# EAGLE board sensormain_Exodia ver2 (EAGLE 9.6.2)
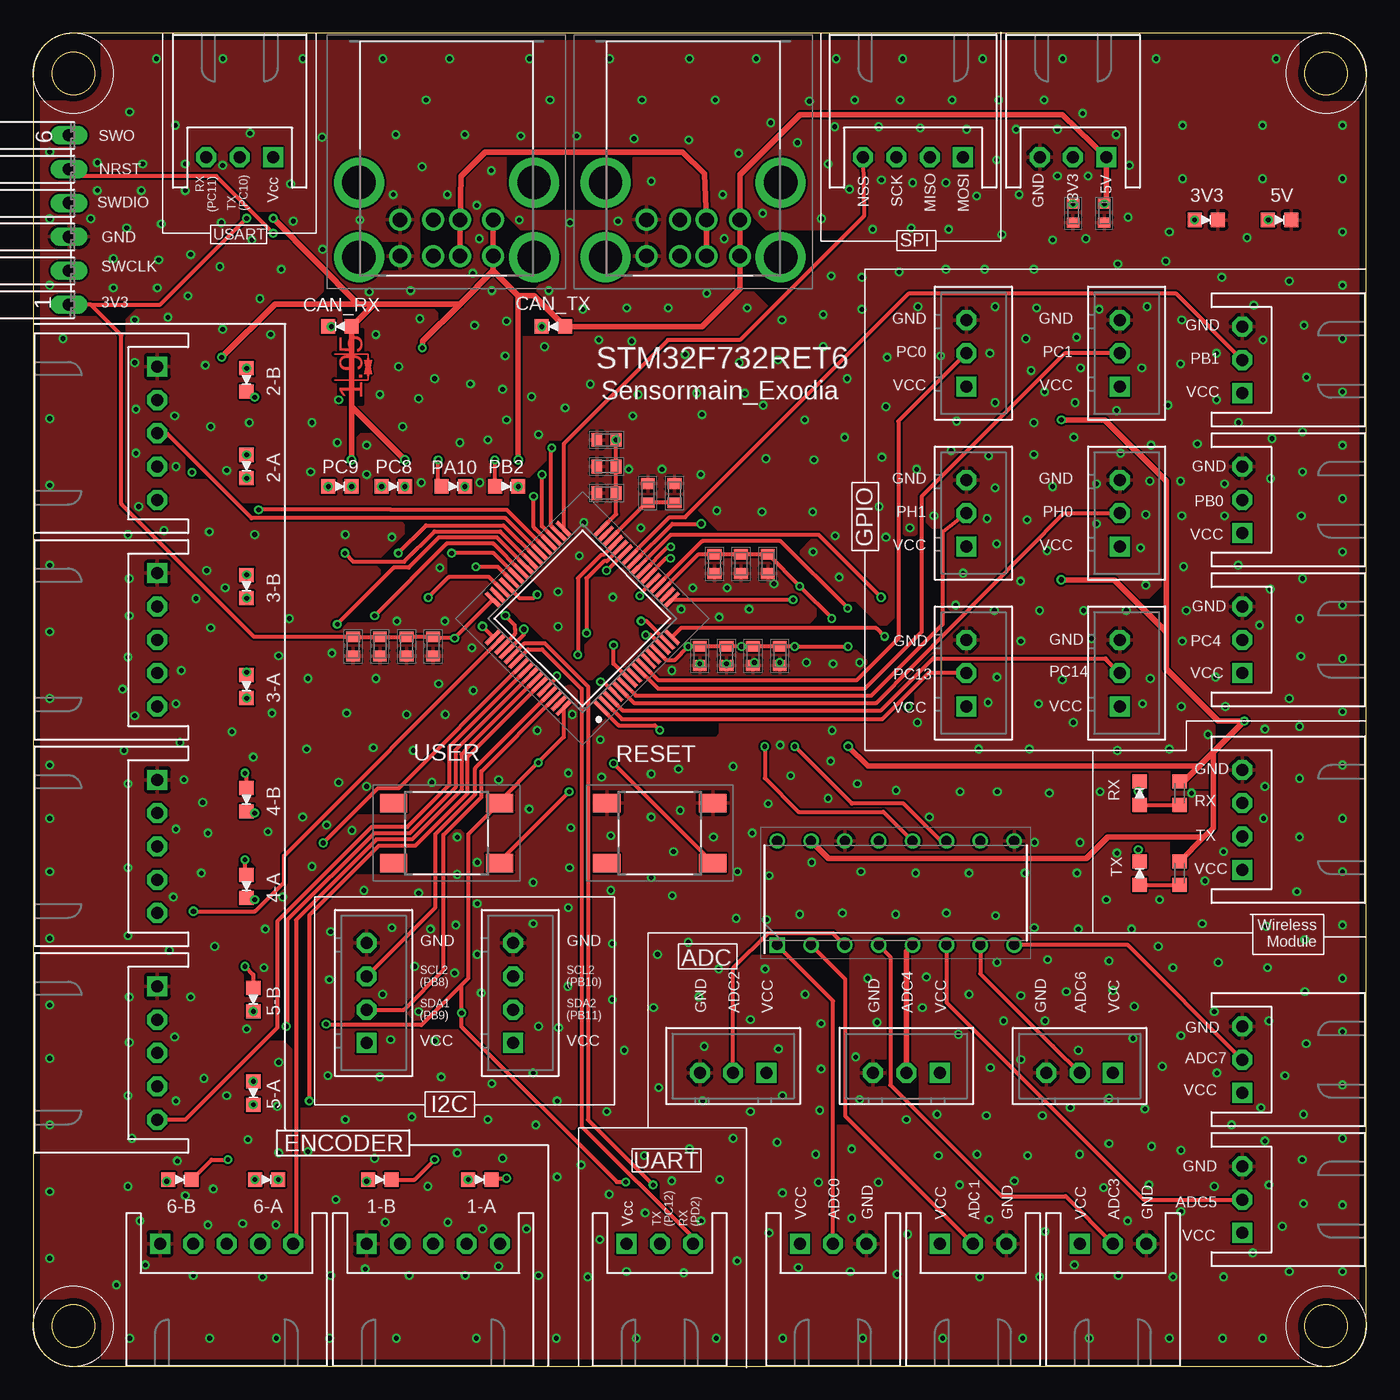
[diagram p5: board, top side]
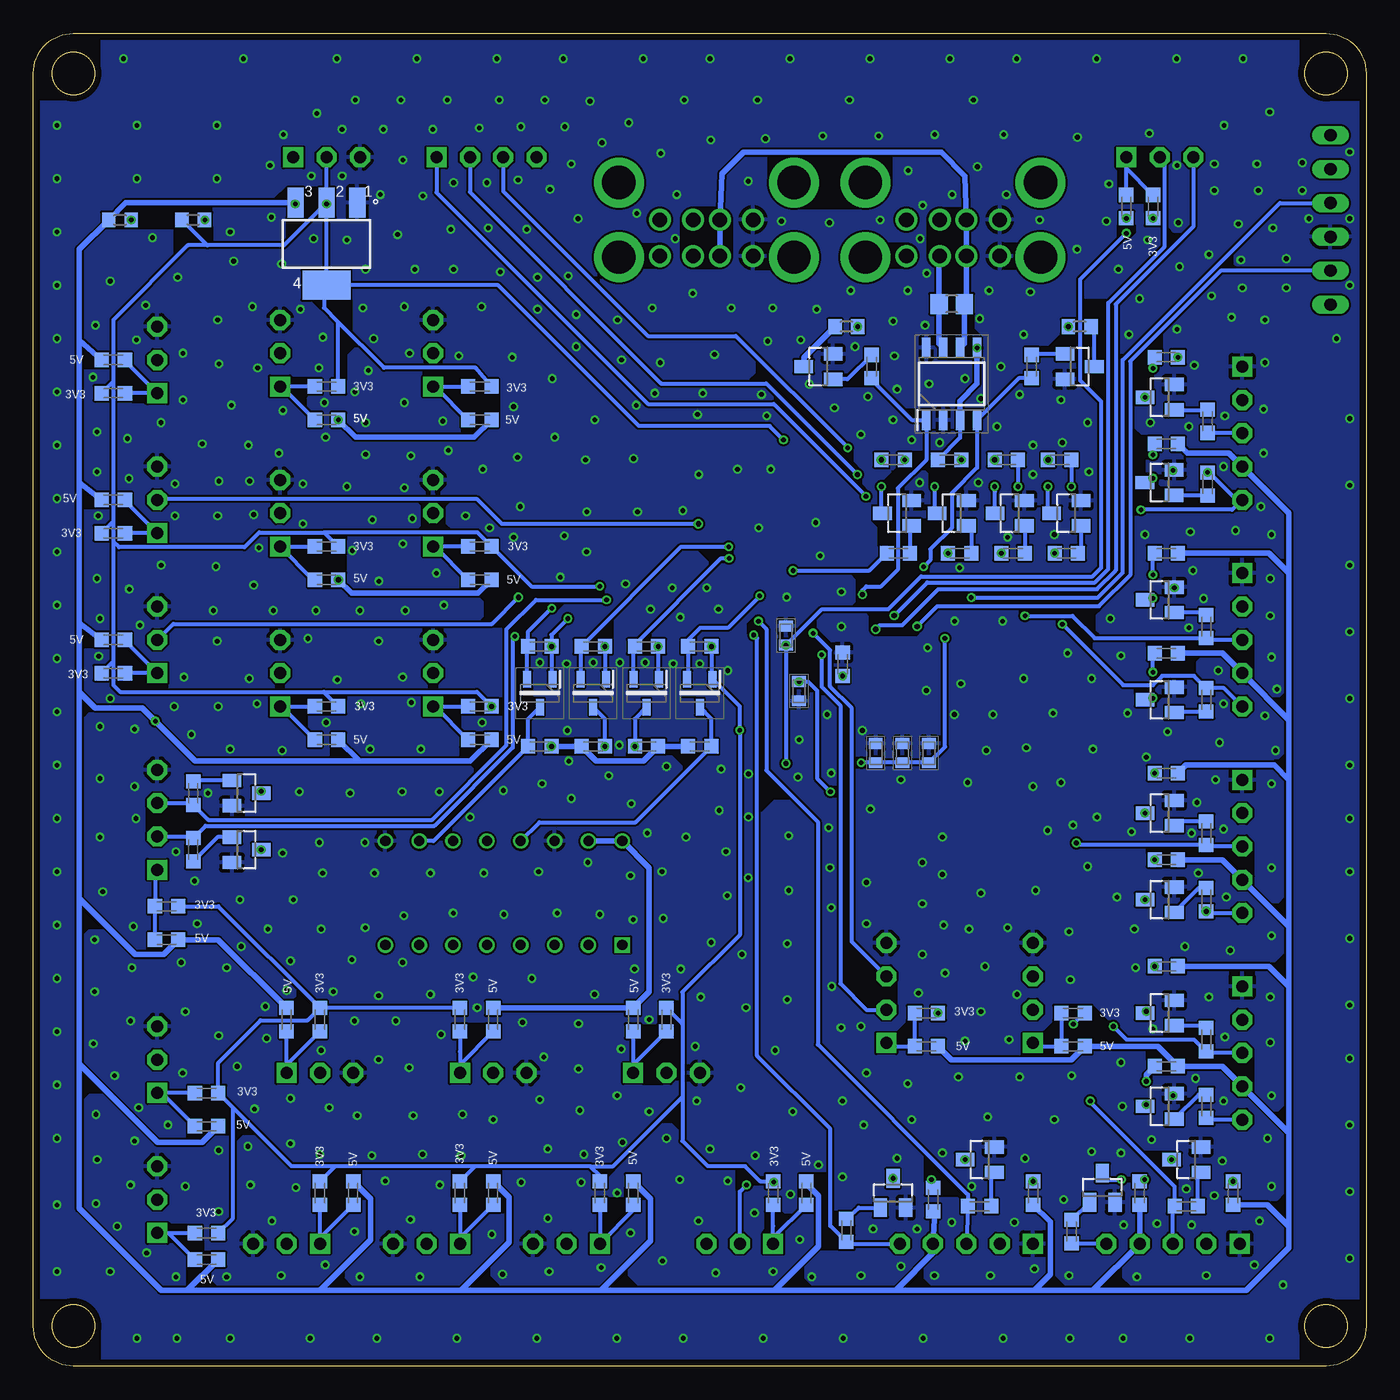
[diagram p6: board, bottom side, seen from below]

Size 100 x 100 mm. Coordinates in mm from the lower left corner, seen from the top.
Outline: 3,0 97,0 arc90 100,3 100,97 arc90 97,100 3,100 arc90 0,97 0,3 arc90 3,0
Outline: circle at 3,3 radius 1.6
Outline: circle at 3,97 radius 1.6
Outline: circle at 97,97 radius 1.6
Outline: circle at 97,3 radius 1.6
Copper layers (1*16): Top 0.035mm / dielectric 1.6mm / Bottom 0.035mm
Design rules "Elecrow_2-layer_PCB_eagle_rule": minimum track width 6mil, minimum drill 12mil, track to track 6mil, track to pad 6mil, pad to pad 6mil, via to via 8mil, smd to smd 0mil, copper to edge 20mil, drill to drill 10mil, minimum pad ring 6mil, minimum via ring 6mil, stop-mask expansion 0mil, vias tented up to drill 100mil, thermal gap 10mil
tRestrict: 181 lines
bRestrict: 311 lines

## Footprints (pad centres in the part's own frame; a part is rotated, then mirrored left to right if it is on the bottom)
LED1608 = smd 1.05 x 1.08: A -0.875,0; K 0.875,0
CAPC1709X100N = smd 0.81 x 1.04: 1 -0.72,0; 2 0.72,0
CAPC1608X90N = smd 0.75 x 0.94: 1 -0.7,0; 2 0.7,0
QFP50P1200X1200X160-64N = smd 1.475 x 0.3: 1 -5.738,3.75; 2 -5.738,3.25; 3 -5.738,2.75; 4 -5.738,2.25; 5 -5.738,1.75; 6 -5.738,1.25; 7 -5.738,0.75; 8 -5.738,0.25; 9 -5.738,-0.25; 10 -5.738,-0.75; 11 -5.738,-1.25; 12 -5.738,-1.75; 13 -5.738,-2.25; 14 -5.738,-2.75; 15 -5.738,-3.25; 16 -5.738,-3.75; 33 5.738,-3.75; 34 5.738,-3.25; 35 5.738,-2.75; 36 5.738,-2.25; 37 5.738,-1.75; 38 5.738,-1.25; 39 5.738,-0.75; 40 5.738,-0.25; 41 5.738,0.25; 42 5.738,0.75; 43 5.738,1.25; 44 5.738,1.75; 45 5.738,2.25; 46 5.738,2.75; 47 5.738,3.25; 48 5.738,3.75 | smd 0.3 x 1.475: 17 -3.75,-5.738; 18 -3.25,-5.738; 19 -2.75,-5.738; 20 -2.25,-5.738; 21 -1.75,-5.738; 22 -1.25,-5.738; 23 -0.75,-5.738; 24 -0.25,-5.738; 25 0.25,-5.738; 26 0.75,-5.738; 27 1.25,-5.738; 28 1.75,-5.738; 29 2.25,-5.738; 30 2.75,-5.738; 31 3.25,-5.738; 32 3.75,-5.738; 49 3.75,5.738; 50 3.25,5.738; 51 2.75,5.738; 52 2.25,5.738; 53 1.75,5.738; 54 1.25,5.738; 55 0.75,5.738; 56 0.25,5.738; 57 -0.25,5.738; 58 -0.75,5.738; 59 -1.25,5.738; 60 -1.75,5.738; 61 -2.25,5.738; 62 -2.75,5.738; 63 -3.25,5.738; 64 -3.75,5.738
SOIC127P600X175-8N = smd 1.5 x 0.65: 1 -2.7,1.905; 2 -2.7,0.635; 3 -2.7,-0.635; 4 -2.7,-1.905; 5 2.7,-1.905; 6 2.7,-0.635; 7 2.7,0.635; 8 2.7,1.905
DIP781W56P254L1918H533Q16N = drill 0.759 pad 1.159 square: 1 -3.905,8.89 | drill 0.759 pad 1.159: 2 -3.905,6.35; 3 -3.905,3.81; 4 -3.905,1.27; 5 -3.905,-1.27; 6 -3.905,-3.81; 7 -3.905,-6.35; 8 -3.905,-8.89; 9 3.905,-8.89; 10 3.905,-6.35; 11 3.905,-3.81; 12 3.905,-1.27; 13 3.905,1.27; 14 3.905,3.81; 15 3.905,6.35; 16 3.905,8.89
USB4AF203AS = drill 1.1 pad 1.65: 1 0,0; 2 2.5,0; 3 4.5,0; 4 7,0; 5 0,-2.71; 6 2.5,-2.71; 7 4.5,-2.71; 8 7,-2.71 | drill 2.5 pad 3.75: MH1 -3.07,0.09; MH2 10.07,0.09; MH3 -3.07,-5.51; MH4 10.07,-5.51
SOT96P237X111-3N = smd 1.25 x 0.6: 1 -1.05,0.955; 2 -1.05,-0.955; 3 1.05,0
SOT-23 = smd 1 x 1.4: 1 -0.95,-1.1; 2 0.95,-1.1; 3 0,1.1
1608 = smd 1.05 x 1.08: 1 -0.875,0; 2 0.875,0
R0603 = smd 1 x 1.1: 1 -0.85,0; 2 0.85,0
SMD1608 = smd 1.05 x 1.08: 1 -0.875,0; 2 0.875,0
R0805 = smd 1.3 x 1.5: 1 -0.95,0; 2 0.95,0
TSHAT25B219E = smd 2.05 x 1.4: A1 -3.975,2.25; B1 3.975,2.25; C1 -3.975,-2.25; D1 3.975,-2.25
06PA = drill 0.914 long: 1 -6.35,0; 2 -3.81,0; 3 -1.27,0; 4 1.27,0; 5 3.81,0; 6 6.35,0
SOT223 = smd 2.235 x 1.219: 1 -3.099,2.311; 2 -3.099,0; 3 -3.099,-2.311 | smd 2.2 x 3.6: 4 3.099,0
S5B-XH-A = drill 0.9 pad 1.5 square: 1 5,0 | drill 0.9 pad 1.5 octagon: 2 2.5,0; 3 0,0; 4 -2.5,0; 5 -5,0
B3B-XH-A = drill 0.9 pad 1.5 square: 1 2.5,0 | drill 0.9 pad 1.5 octagon: 2 0,0; 3 -2.5,0
S4B-XH-A = drill 0.9 pad 1.5 square: 1 3.75,0 | drill 0.9 pad 1.5 octagon: 2 1.25,0; 3 -1.25,0; 4 -3.75,0
S3B-XH-A = drill 0.9 pad 1.5 square: 1 2.5,0 | drill 0.9 pad 1.5 octagon: 2 0,0; 3 -2.5,0
B4B-XH-A = drill 0.9 pad 1.5 square: 1 3.75,0 | drill 0.9 pad 1.5 octagon: 2 1.25,0; 3 -1.25,0; 4 -3.75,0

## Placement (x,y rotation side)
1-A  LED1608  [LED1608]  33.5,14 0 top
1-B  LED1608  [LED1608]  26,14 0 top
2-A  LED1608  [LED1608]  16,67.5 270 top
2-B  LED1608  [LED1608]  16,74 270 top
3-A  LED1608  [LED1608]  16,51 270 top
3-B  LED1608  [LED1608]  16,58.5 270 top
3V3  LED1608  [LED1608]  88,86 0 top
4-A  LED1608  [LED1608]  16,36 270 top
4-B  LED1608  [LED1608]  16,42.5 270 top
5-A  LED1608  [LED1608]  16.5,20.5 270 top
5-B  LED1608  [LED1608]  16.5,27.5 270 top
5V  LED1608  [LED1608]  93.5,86 0 top
6-A  LED1608  [LED1608]  17.5,14 0 top
6-B  LED1608  [LED1608]  11,14 0 top
C1  100n  [CAPC1709X100N]  42.55,50.64 90 bottom
C2  10uF  [CAPC1608X90N]  78,86.5 90 top
C3  100n  [CAPC1709X100N]  50,53.3 90 top
C4  1u  [CAPC1709X100N]  56,53.3 90 top
C5  100n  [CAPC1709X100N]  30,54 90 top
C6  100n  [CAPC1709X100N]  28,54 90 top
C7  100n  [CAPC1709X100N]  26,54 90 top
C8  100n  [CAPC1709X100N]  43,69.5 0 top
C9  100n  [CAPC1709X100N]  43,67.5 0 top
C10  100n  [CAPC1709X100N]  43,65.5 0 top
C11  100n  [CAPC1709X100N]  53.1,60.2 90 top
C12  100n  [CAPC1709X100N]  51.1,60.2 90 top
C13  100n  [CAPC1709X100N]  55.1,60.2 90 top
C14  100n  [CAPC1709X100N]  32.8,46 270 bottom
C15  100n  [CAPC1709X100N]  34.8,46 270 bottom
C16  100n  [CAPC1709X100N]  36.8,46 270 bottom
C17  4.7u  [CAPC1709X100N]  24,54 90 top
C18  100n  [CAPC1709X100N]  52,53.3 90 top
C19  1u  [CAPC1709X100N]  54,53.3 90 top
C20  2.2u  [CAPC1709X100N]  46.1,65.5 270 top
C21  2.2u  [CAPC1709X100N]  48.1,65.5 270 top
C22  100n  [CAPC1608X90N]  80.35,86.5 90 top
C23  100n  [CAPC1709X100N]  43.53,54.82 270 bottom
CAN_RX  LED1608  [LED1608]  23,78 180 top
CAN_TX  LED1608  [LED1608]  39,78 180 top
IC1  STM32F732RET6  [QFP50P1200X1200X160-64N]  41.2,56.1 135 top
IC2  NCV7351D1ER2G  [SOIC127P600X175-8N]  31.1,73.7 90 bottom
IC4  MCP3208-CI_P  [DIP781W56P254L1918H533Q16N]  64.7,35.5 90 top
J1  USB-4AF203AS  [USB4AF203AS]  53,83.3 180 top
J2  USB-4AF203AS  [USB4AF203AS]  34.5,83.3 180 top
PA10  LED1608  [LED1608]  31.5,66 0 top
PB2  LED1608  [LED1608]  35.5,66 0 top
PC8  LED1608  [LED1608]  27,66 0 top
PC9  LED1608  [LED1608]  23,66 0 top
Q1  BSS138LT7G  [SOT96P237X111-3N]  62,50.5 270 bottom
Q2  BSS138LT7G  [SOT96P237X111-3N]  58,50.5 270 bottom
Q3  BSS138LT7G  [SOT96P237X111-3N]  54,50.5 270 bottom
Q5  BSS138LT7G  [SOT96P237X111-3N]  50,50.5 270 bottom
Q9  SOT-23_NMOS  [SOT-23]  41.1,75 90 bottom
Q10  SOT-23_NMOS  [SOT-23]  21.5,75 270 bottom
R1  10k  [1608]  39.28,52.66 90 bottom
R2  1k  [R0603]  88,86 0 bottom
R3  1k  [R0603]  93.5,86 0 bottom
R4  10k  [SMD1608]  12,35 90 bottom
R5  120  [R0805]  31.1,79.7 180 bottom
R6  1k  [SMD1608]  15,38 180 bottom
R7  10k  [SMD1608]  12,19.5 90 bottom
R8  1k  [SMD1608]  15,22.5 180 bottom
R9  10k  [SMD1608]  22.1,10.1 90 bottom
R10  1k  [SMD1608]  17,13 90 bottom
R11  10k  [SMD1608]  29,12 0 bottom
R12  1k  [SMD1608]  25,13 270 bottom
R13  10k  [SMD1608]  11.9,70.9 90 bottom
R14  1k  [SMD1608]  15,75.7 180 bottom
R15  10k  [SMD1608]  12,55.5 90 bottom
R16  1k  [SMD1608]  15,61 180 bottom
R17  10k  [SMD1608]  12,40 90 bottom
R18  1k  [SMD1608]  15,44.5 180 bottom
R19  10k  [SMD1608]  12,24.5 90 bottom
R20  1k  [SMD1608]  15,30 180 bottom
R21  10k  [SMD1608]  13.5,12 0 bottom
R22  1k  [SMD1608]  10,13 90 bottom
R23  10k  [SMD1608]  62,54 180 bottom
R24  10k  [SMD1608]  62,46.5 180 bottom
R25  10k  [SMD1608]  58,54 180 bottom
R26  10k  [SMD1608]  58,46.5 0 bottom
R27  10k  [SMD1608]  54,54 180 bottom
R28  10k  [SMD1608]  54,46.5 180 bottom
R29  10k  [SMD1608]  50,54 180 bottom
R30  10k  [SMD1608]  50,46.5 0 bottom
R31  0  [SMD1608]  90,34.5 0 bottom
R32  0  [SMD1608]  90,32 0 bottom
R33  [SMD1608]  68,13 270 bottom
R34  [SMD1608]  65.5,13 270 bottom
R35  [SMD1608]  57.5,13 270 bottom
R36  [SMD1608]  55,13 270 bottom
R37  [SMD1608]  52.5,26 270 bottom
R38  [SMD1608]  55,26 270 bottom
R39  [SMD1608]  78.5,13 270 bottom
R40  [SMD1608]  76,13 270 bottom
R41  [SMD1608]  68,26 270 bottom
R42  [SMD1608]  65.5,26 270 bottom
R43  [SMD1608]  87,10 180 bottom
R44  [SMD1608]  87,8 180 bottom
R45  [SMD1608]  78.5,26 270 bottom
R46  [SMD1608]  81,26 270 bottom
R47  10k  [SMD1608]  39,10.2 90 bottom
R48  1k  [SMD1608]  32.5,12.5 90 bottom
R49  10k  [SMD1608]  11.9,66.18 270 bottom
R50  1k  [SMD1608]  15,69.2 180 bottom
R51  [SMD1608]  87,20.5 180 bottom
R52  [SMD1608]  87,18 180 bottom
R53  10k  [SMD1608]  12,50 270 bottom
R54  1k  [SMD1608]  15,53.5 180 bottom
R55  10k  [SMD1608]  88,38.75 270 bottom
R56  1k  [SMD1608]  86,37 270 top
R57  10k  [SMD1608]  88,43 90 bottom
R58  1k  [SMD1608]  86,43 270 top
R59  10k  [SMD1608]  30.5,61 0 bottom
R60  1k  [SMD1608]  31.25,68 0 bottom
R61  10k  [SMD1608]  22.5,61 0 bottom
R62  1k  [SMD1608]  23,68 0 bottom
R63  10k  [SMD1608]  26.5,61 0 bottom
R64  1k  [SMD1608]  27,68 0 bottom
R65  10k  [SMD1608]  35.1,61 0 bottom
R66  1k  [SMD1608]  35.5,68 0 bottom
R67  0  [SMD1608]  33,26.5 0 bottom
R68  0  [SMD1608]  33,24 0 bottom
R69  0  [SMD1608]  22,26.5 0 bottom
R70  0  [SMD1608]  22,24 0 bottom
R71  0  [SMD1608]  16,87 270 bottom
R72  0  [SMD1608]  18,87 270 bottom
R73  0  [SMD1608]  44.5,13 90 bottom
R74  0  [SMD1608]  42,13 90 bottom
R75  1k  [R0603]  39,78 180 bottom
R76  1k  [R0603]  21.5,78 0 bottom
R77  10k  [SMD1608]  37.1,75 270 bottom
R78  10k  [SMD1608]  25.1,75 270 bottom
R81  [SMD1608]  78,73.5 180 bottom
R82  [SMD1608]  78,71 180 bottom
R85  [SMD1608]  66.5,73.5 180 bottom
R86  [SMD1608]  66.5,71 180 bottom
R87  [SMD1608]  94,52 0 bottom
R88  [SMD1608]  94,54.5 0 bottom
R89  [SMD1608]  94,62.5 0 bottom
R90  [SMD1608]  94,65 0 bottom
R91  [SMD1608]  94,73 0 bottom
R92  [SMD1608]  94,75.5 0 bottom
R95  [SMD1608]  78,61.5 180 bottom
R96  [SMD1608]  78,59 180 bottom
R97  [SMD1608]  66.5,61.5 180 bottom
R98  [SMD1608]  66.5,59 180 bottom
R99  [SMD1608]  66.5,49.5 180 bottom
R100  [SMD1608]  66.5,47 180 bottom
R101  [SMD1608]  78,49.5 180 bottom
R102  [SMD1608]  78,47 180 bottom
RX  LED1608  [LED1608]  83,43 90 top
S1  TSHA-T-2.5B2-19E  [TSHAT25B219E]  31,40 180 top
S2  TSHA-T-2.5B2-19E  [TSHAT25B219E]  47,40 180 top
SL1  [06PA]  2.68,86 90 top
TR1  2SC2712GR  [SOT-23]  15.5,35 90 bottom
TR2  2SC2712GR  [SOT-23]  15.5,19.5 90 bottom
TR3  2SC2712GR  [SOT-23]  19.8,13.4 0 bottom
TR4  2SC2712GR  [SOT-23]  29,15.5 90 bottom
TR5  2SC2712GR  [SOT-23]  15.5,72.7 90 bottom
TR6  2SC2712GR  [SOT-23]  15.5,57.5 90 bottom
TR7  2SC2712GR  [SOT-23]  15.5,41.5 90 bottom
TR8  2SC2712GR  [SOT-23]  15.5,26.5 90 bottom
TR9  2SC2712GR  [SOT-23]  13.5,15.5 90 bottom
TR10  2SC2712GR  [SOT-23]  84,38.75 270 bottom
TR11  2SC2712GR  [SOT-23]  84,43 270 bottom
TR12  2SC2712GR  [SOT-23]  31.1,64 90 bottom
TR13  2SC2712GR  [SOT-23]  22.5,64 90 bottom
TR14  2SC2712GR  [SOT-23]  26.75,64 90 bottom
TR15  2SC2712GR  [SOT-23]  35.5,13 0 bottom
TR16  2SC2712GR  [SOT-23]  15.51,66.3 90 bottom
TR17  2SC2712GR  [SOT-23]  35.2,64 90 bottom
TR21  2SC2712GR  [SOT-23]  15.5,50 90 bottom
TX  LED1608  [LED1608]  83,37 90 top
U1  LD1117S33CTR  [SOT223]  78,84.2 270 bottom
X1  S5B-XH-A  [S5B-XH-A]  30,9.2 180 top
X2  S5B-XH-A  [S5B-XH-A]  9.3,70 90 top
X3  S5B-XH-A  [S5B-XH-A]  9.3,54.5 90 top
X4  S5B-XH-A  [S5B-XH-A]  9.3,39 90 top
X5  S5B-XH-A  [S5B-XH-A]  9.3,23.5 90 top
X6  S5B-XH-A  [S5B-XH-A]  14.5,9.2 180 top
X7  B3B-XH-A  [B3B-XH-A]  52.5,22 0 top
X8  S4B-XH-A  [S4B-XH-A]  66,90.7 0 top
X9  S4B-XH-A  [S4B-XH-A]  90.7,41 270 top
X10  B3B-XH-A  [B3B-XH-A]  65.5,22 0 top
X11  S3B-XH-A  [S3B-XH-A]  47,9.2 180 top
X12  S3B-XH-A  [S3B-XH-A]  60,9.2 180 top
X13  S3B-XH-A  [S3B-XH-A]  15.48,90.7 0 top
X14  B4B-XH-2  [B4B-XH-A]  25,28 270 top
X17  B4B-XH-2  [B4B-XH-A]  36,28 270 top
X18  S3B-XH-A  [S3B-XH-A]  90.7,12.5 270 top
X20  B3B-XH-A  [B3B-XH-A]  78.5,22 0 top
X21  S3B-XH-A  [S3B-XH-A]  90.7,23 270 top
X22  S3B-XH-A  [S3B-XH-A]  78,90.7 0 top
X23  S3B-XH-A  [S3B-XH-A]  81,9.2 180 top
X24  B3B-XH-A  [B3B-XH-A]  81.5,76 270 top
X25  S3B-XH-A  [S3B-XH-A]  70.5,9.2 180 top
X27  B3B-XH-A  [B3B-XH-A]  70,76 270 top
X28  S3B-XH-A  [S3B-XH-A]  90.7,54.5 270 top
X29  S3B-XH-A  [S3B-XH-A]  90.7,65 270 top
X30  S3B-XH-A  [S3B-XH-A]  90.7,75.5 270 top
X32  B3B-XH-A  [B3B-XH-A]  81.5,64 270 top
X33  B3B-XH-A  [B3B-XH-A]  70,64 270 top
X34  B3B-XH-A  [B3B-XH-A]  70,52 270 top
X35  B3B-XH-A  [B3B-XH-A]  81.5,52 270 top

## Tracks (layer width: path | path; a pad name or v marks a point on that pad's centre or on a via)
3V3  (via drill 0.35)
  Top 0.305: IC1.19 49.91,60.92 C12.2 C11.2 C13.2 v57.51,58.51 59.9,56.12 v59.9,56.1 | IC1.48 v31.61,54.62 30.1,54.62 C5.2 C6.2 C7.2 C17.2 16.58,54.72 6.6,64.7 6.6,77.35 4.3,79.65 | IC1.64 39.79,47.2 v37.88,45.28 34.98,42.38 S1.C1 32.62,39.9 32.62,29.1 32.12,28.6 | IC1.13 47.48,53 48.12,53 R29.1 49.15,54.02 C3.2 C18.2 53.1,54.02 R27.1 53.15,54.02 C19.2 C4.2 57.1,54.02 R25.1 R23.1 | 32.12,28.6 R67.2 32.12,25.48 43.78,13.82 v44.44,13.82 | 32.12,28.6 29.12,25.6 22.03,25.6 v21.97,25.67 | 4.3,79.65 9.53,79.65 R71.2 | 4.3,79.65 SL1.1 | IC1.32 43.72,63.92 C10.2 C9.2 C8.2 | v47,47.72 46.63,48.09 43.91,48.09 IC1.1
  Bottom 0.305: U1.2 81.2,84.1 86.95,84.1 | 86.95,84.1 R2.1 | U1.4 U1.2 | U1.2 X22.2 | R101.1 77.19,49.58 78.2,50.6 | R41.1 R45.1 | 58.23,15 57.5,14.28 R35.1 | R33.1 66.88,15 | 58.23,15 66.88,15 | 66.88,15 77.38,15 | 77.38,15 R39.1 | 77.38,15 80.62,15 85.01,19.39 | 85.01,19.39 R51.1 86.12,22.77 82.94,25.95 79.42,25.95 R45.1 | R43.1 85.01,11.11 85.01,19.39 | 58.23,15 56.5,15 51.3,20.2 | 51.3,25.68 51.3,20.2 | 51.3,25.68 R37.1 | R31.2 86.12,34.5 R45.1 | v37.88,45.28 C16.2 C15.2 C14.2 31.61,46.48 v31.61,54.62 | U1.4 65.12,81.1 54.56,70.54 44.76,70.54 C8.2 | R85.1 66.83,74.9 73.7,74.9 77.12,78.33 | 77.12,78.33 78.2,79.4 78.2,80.9 U1.4 | 51.3,20.2 51.3,16.9 49.4,15 46.6,15 45.48,13.88 R73.2 v44.44,13.82 | 86.95,84.1 88.4,84.1 94,78.5 94,73.88 | 94,73.88 R91.1 | 94,73.88 94,63.38 | 94,63.38 R89.1 | 94,63.38 94,61.88 | 94,61.88 94,52.88 | 94,52.88 R87.1 | 94,52.88 94,51.1 93.5,50.6 78.2,50.6 | 51.3,25.68 51.3,28.07 47,32.38 v47,47.72 47,49.51 Q5.1 49.12,51.63 R29.1 | v21.97,25.67 R69.2 | R81.1 77.12,78.33 | 78.2,50.6 66.72,50.6 R99.1 | 78.18,62.55 83.05,62.55 84.16,61.45 93.57,61.45 94,61.88 | 78.18,62.55 66.68,62.55 R97.1 62.63,58.51 v57.51,58.51 | Q1.1 61.12,51.63 R23.1 61.12,54.88 v59.9,56.1 | R25.1 57.12,51.63 Q2.1 | R27.1 53.12,51.63 Q3.1 | R95.1 78.18,62.55
  Bottom 0.406: U1.2 78.07,87.23 C2.2
  other vias: 78,87.2 43.72,69.5 32.12,26.5 16,86.12 49.12,54 53.12,54 57.12,54 61.12,54 65.62,49.5
5V  (via drill 0.35, 0.4)
  Top 0.406: 32,79.7 25.57,79.7 | 25.57,79.7 CAN_RX.A 23.88,72 | 32,79.7 34.5,82.2 | 32,79.7 29.2,76.89 IC2.5 | 25.57,79.7 24.36,79.7 | R72.2 24.36,79.7 | R14.1 18.12,79.7 24.36,79.7 | R58.1 86.33,43.88 87.47,45.02 | 88.53,46.08 87.47,45.02 | 88.53,46.08 v90.85,48.4 88.9,48.4 85,52.3 85,55.1 | R56.1 87.83,39.7 | 87.83,39.7 88.53,40.4 88.53,46.08 | R64.1 23.88,72 | 23.88,72 R62.1 | 36.38,80.33 R66.1 | R24.1 62.6,45.02 87.47,45.02 | 85,55.1 81.1,59 R96.1 | IC4.15 59.66,38.1 79,38.1 80.6,39.7 87.83,39.7 | 85,55.1 85,66.4 80.4,71 R82.1 | J2.5 J2.1 34.5,82.2 | 34.5,82.2 36.38,80.33 | 36.38,80.33 37.55,80.33 CAN_TX.A 50.15,78 53,80.85 J1.1 J1.5 53,89.4 57.5,93.9 77.19,93.9 X22.1 80.5,87.35 C22.2
  Bottom 0.305: IC2.3 30.46,69.66 R60.1
  Bottom 0.406: 96.55,76.97 96.55,83.8 R3.1 93.05,87.3 U1.3 80.35,87.26 C22.2 | 96.55,76.97 96.55,66.28 | 96.55,66.28 96.55,55.77 | 96.55,55.77 96.55,50.6 | 96.55,50.6 96.55,35.1 | 96.55,35.1 96.55,22.7 | 96.55,22.7 96.55,11.85 90.4,5.7 88.4,5.7 | 88.4,5.7 78.5,5.7 | 78.5,5.7 67.9,5.7 | 67.9,5.7 57.4,5.7 | 57.4,5.7 44.4,5.7 | 44.4,5.7 35.3,5.7 | 35.3,5.7 24.9,5.7 | 24.9,5.7 20.52,5.7 | 20.52,5.7 9,5.7 5.8,8.9 5.8,10.5 | 5.8,10.5 5.8,17.5 | 5.8,17.5 5.8,28.5 | 5.8,28.5 5.8,33 | 5.8,33 5.8,44 | 5.8,44 5.8,48.5 | 5.8,48.5 5.8,59.5 | 5.8,59.5 5.8,64 X2.4 10.3,68.5 13.43,68.5 R50.1 | R30.1 R28.1 54.23,45.4 57.77,45.4 R26.1 R24.1 | R22.1 7.42,12.12 5.8,10.5 | R48.1 32.38,11.01 X1.4 32.38,8.62 35.3,5.7 | R36.1 53.7,12.57 53.7,9.4 57.4,5.7 | R74.2 42,13.69 41.1,12.8 41.1,9 44.4,5.7 | 5.8,33 X4.4 10.8,38 R6.1 | 5.8,48.5 X3.4 10.8,53.5 R54.1 | 20.52,5.7 X6.4 R10.1 | R44.1 88.4,5.72 88.4,5.7 | R40.1 74.7,12.57 74.7,9.5 78.5,5.7 | R52.1 87.33,16.8 90.65,16.8 96.55,22.7 | R46.1 86.12,32 R32.2 90.22,30.9 92.35,30.9 96.55,35.1 | R42.1 R38.1 53.8,28.07 53.8,37.4 IC4.16 IC4.15 | R34.1 64.3,12.68 64.3,9.3 67.9,5.7 | 96.55,50.6 95.35,49.4 91.85,49.4 v90.85,48.4 87.85,45.4 75.53,45.4 | R16.1 7.3,61 5.8,59.5 | 5.8,17.5 X5.4 10.8,22.5 R8.1 15.62,24 R70.2 22.12,23 31.12,23 R68.2 | R20.1 7.3,30 5.8,28.5 | IC2.5 29.2,73.7 30.5,72.4 30.5,71.03 IC2.3 | R88.1 96.55,55.77 | R90.1 96.55,66.28 | R92.1 96.55,76.97 | R86.1 66.92,69.7 75.83,69.7 R82.1 | R100.1 67.22,45.4 75.53,45.4 | R102.1 75.53,45.4 | R98.1 66.62,58 76.12,58 R96.1 | R12.2 23.7,10.82 23.7,6.9 24.9,5.7 | R18.1 13.52,45.11 6.91,45.11 5.8,44
  other vias: 29.2,76.4 18,86.12 14.12,75.7 23.88,68 27.88,68 36.38,68 61.12,46.5 77.12,59 77.12,71 80.35,87.2
ADC0
  Top 0.305: X12.2 60,27.41 IC4.1
ADC1
  Top 0.305: IC4.2 60.9,29.05 60.9,18.8 X25.2
ADC2
  Top 0.305: X7.2 52.5,29.88 55.1,32.48 60.01,32.48 IC4.3
ADC3
  Top 0.305: X23.2 77.45,12.75 72.65,12.75 64.3,21.1 64.3,30.73 IC4.4
ADC4
  Top 0.406: IC4.5 65.5,31.12 X10.2
ADC5
  Top 0.305: X18.2 83.3,12.5 68.51,27.29 IC4.6
ADC6
  Top 0.305: IC4.7 71.05,29.45 76.5,24 X20.2
ADC7
  Top 0.305: X21.2 82.11,31.59 IC4.8
CAN_RX  (via drill 0.35)
  Top 0.305: IC1.44 34.86,59.97 v33.2,59.97
  Bottom 0.305: R78.2 26.07,74.12 IC2.4 29.2,67.41 31.1,65.5 31.1,62.9 32.7,61.3 32.7,60.47 v33.2,59.97
CAN_TX  (via drill 0.35)
  Top 0.305: IC1.45 36.52,57.6 37.5,57.6 v37.8,57.9
  Bottom 0.305: R77.2 37.1,74 34.1,71 IC2.1 33.01,68 35.13,65.87 35.13,59.77 36.4,58.5 37.5,58.5 37.8,58.2 v37.8,57.9
CANH
  Top 0.406: J2.2 J2.6 32.1,89.3 33.88,91.08 48.72,91.08 50.35,89.45 J1.6 J1.2
  Bottom 0.406: IC2.7 32.05,76.72 R5.2 32.05,83.25 J2.2
CANL
  Bottom 0.406: J1.3 J1.7 48.35,89.45 46.72,91.08 31.88,91.08 30.1,89.3 J2.7 J2.3 30,79.85 R5.1 30.15,76.72 IC2.6
ENCODER1-A  (via drill 0.35)
  Top 0.305: IC1.14 46.34,54.85 v45.95,54.85
  Bottom 0.305: v45.95,54.85 45.7,54.6 45.7,23.3 40.2,17.8 40.2,10.53 R47.1 38.77,9.2 X1.5
ENCODER1-B  (via drill 0.35)
  Top 0.305: IC1.15 46,55.9 v45.6,55.9
  Bottom 0.305: X1.3 R11.1 29.88,12.88 41.14,24.14 41.14,40.84 45,44.7 45,55.3 v45.6,55.9
ENCODER2-A  (via drill 0.35)
  Top 0.305: IC1.37 35.7,64.08 35.52,64.25 26.83,64.25 v16.9,64.25
  Bottom 0.305: R49.1 11.76,67.06 9.7,65 X2.5 10.05,64.25 v16.9,64.25
  other vias: 11.9,67.06
ENCODER2-B
  Top 0.305: IC1.38 35.45,63.62 16.38,63.62 10,70 X2.3
  Bottom 0.305: X2.3 11.88,70 R13.1
ENCODER3-A  (via drill 0.35)
  Top 0.305: IC1.41 34.78,62.17 30.42,62.17 28.16,59.91 27.04,59.91 v22.8,55.67
  Bottom 0.305: X3.5 10.68,50.88 R53.1 12.93,51.8 15.3,51.8 16,51.1 18.23,51.1 v22.8,55.67
ENCODER3-B  (via drill 0.35)
  Top 0.305: IC1.42 34.53,61.71 31.01,61.71 v25.6,56.3
  Bottom 0.305: X3.3 11.97,54.5 R15.1 20.36,54.62 22.04,56.3 v25.6,56.3
ENCODER4-A  (via drill 0.4)
  Top 0.305: IC1.50 18.8,38.3 18.8,36.3 16.62,34.12 R4.1
  Bottom 0.305: R4.1 11.88,34 X4.5
  other vias: 12,34.12
ENCODER4-B  (via drill 0.4)
  Top 0.305: IC1.55 27.39,43.35 25.84,43.35 v21.74,39.26
  Bottom 0.305: X4.3 11.88,39 R17.1 21.61,39.12 v21.74,39.26
ENCODER5-A
  Top 0.305: IC1.56 31.21,46.47 31.21,43.6 28.05,40.44 25.37,40.44 18.3,33.37 18.3,25.4 11.4,18.5 X5.5
  Bottom 0.305: X5.5 11.88,18.5 R7.1
ENCODER5-B  (via drill 0.35)
  Top 0.305: IC1.57 31.67,46.22 31.67,43.42 28.23,39.98 25.55,39.98 19.04,33.47 19.04,25.57 v18.97,25.5
  Bottom 0.305: X5.3 11.88,23.5 11.99,23.61 | 11.99,23.61 R19.1 | v18.97,25.5 17.98,24.51 12.91,24.51 12.02,23.61 11.99,23.61
ENCODER6-A
  Top 0.305: IC1.58 32.48,46.32 32.48,46.26 32.13,45.91 32.13,43.23 28.42,39.52 25.74,39.52 19.7,33.48 19.7,9.4 X6.5
  Bottom 0.305: X6.5 22.07,9.2 R9.1
ENCODER6-B  (via drill 0.35)
  Top 0.305: v20.7,19.9 20.7,33.83 25.93,39.07 28.67,39.07 32.58,42.98 32.58,45.72 IC1.59
  Bottom 0.305: X6.3 14.52,11.86 R21.1 14.38,13.47 20.7,19.8 v20.7,19.9
GND  (via drill 0.35)
  other vias: 25,66.9 33.5,66.3 29.1,66.3 41.3,63.3 48.9,75.9 37.9,69.9 39.9,71.9 44.9,76.9 38.35,76.5 37.38,72.74 41.79,73.68 42.43,77 41.23,79.3 44.53,79.4 47.63,79.4 50.53,80.5 51.83,84.6 51.73,87.9 52.93,91 55.33,93.3 58.23,94.9 61.63,95 65.03,95 68.93,95 72.43,95 75.83,95 78.73,94 81.23,92.4 82.23,90.1 79.13,89.3 76.83,89.3 76.83,92.8 73.73,92.8 70.03,92.8 66.53,92.9 63.43,93 60.13,93 57.33,91.8 54.73,86.5 59.13,86.1 61.23,88.3 59.63,90.2 63.63,89 65.97,88.8 68.47,88.8 65.87,85.4 62.97,85.3 59.87,81.8 62.17,81.7 59.27,78.9 56.17,78.5 55.87,75.5 53.57,79.4 52.97,75.3 54.77,72.1 44.67,67.3 45.57,62.9 51.27,64.2 54.67,64.1 58.47,64.1 63.47,64.5 54.97,68.1 57.87,71 61.07,74.1 60.87,69.7 66.37,79.5 72.17,79.5 75.27,79.4 74.47,77.1 71.77,76 68.07,75.8 63.97,72 63.67,68.2 58.57,68 64.07,75.7 69.27,70.9 72.17,72.3 74.87,74.7 78.27,77.2 79.97,79.3 83.57,79.5 86.17,78.5 88.77,76 83.17,74.9 88.77,72.5 81.27,71.7 83.87,69.1 86.07,66.4 89.37,66.2 89.37,63.8 86.17,63.8 83.47,63.9 83.47,58.6 83.07,61.4 83.77,66.4 81.57,68.5 78.07,69.7 75.07,70.8 78.17,72.3 78.57,74.9 75.87,73.1 71.67,68.3 75.07,68.4 72.17,65.9 76.47,66 79.77,66.2 66.27,67.3 68.87,68.7 49.17,92 45.07,92.1 40.77,92.3 36.57,92.3 32.37,92.4 29.17,90 31.07,87.9 34.37,89.7 33.27,87.1 33.47,84.6 32.97,82 34.4,80.7 35.5,78.4 35.4,75.8 35.2,73.3 33.1,78.1 30.1,74.1 32.8,73.7 35.5,71 34.1,69.5 32,69.3 26,72.9 27.7,70.5 28.9,72.6 27.4,75 25.7,77.4 29,78.6 25.2,80.6 28.3,80.7 24.5,86 27,87.9 27.2,92.4 21.7,83.8 19.5,85.9 19.3,88.7 14.2,90.1 11.4,90.2 8.2,90.2 4.8,90.3 4.8,88.2 8.1,88.2 11.4,88.2 9.6,85.7 11.8,83.4 14.1,85.8 16.4,84.5 18.6,82.3 17,80.1 14,82.5 9.4,83 7,85.4 4.3,86.1 6,83.1 9.3,80.9 6,80.9 7.6,78.5 10.1,78.7 11.6,80.3 14.2,77.8 12.9,75.1 7.6,75.3 7.7,71.8 7.7,68.5 7.9,64.5 9.8,62.7 13.2,62.6 10.7,67.5 13,59.7 12.2,57.6 7.2,59.1 7.1,62.4 7.2,56.3 7.1,53.2 6.7,50.8 6.8,46.2 7.6,48.8 11.1,52.2 22.4,53.5 20.6,51.6 17.9,49 14.9,47.6 10.7,49.7 11,46.8 11.3,44 7.1,43.7 7.1,37.4 7.1,32.3 13.6,31.5 17.3,29.9 17.4,32.8 10.5,35.2 12.6,37 18.7,35.2 20.9,37.5 23.9,40.2 29.9,43.8 22,40.6 25,43.5 28.5,46.2 30.9,48.9 33,50.7 32.9,53.9 30.4,51.2 28,48.9 25.5,46.4 22.9,43.8 20.2,41.2 17.6,40.1 12.7,42.3 10.7,40.3 16.5,45.7 20.5,46.3 23.5,49 25.7,51.6 13.3,70.5 10.6,71.3 16.2,70.8 20.8,67.1 20.9,70.8 22.9,72.5 25,69.1 22.8,69.3 17.8,77.4 48.6,56.8 53.7,56.8 58.5,61.1 60,52.7 56,52.8 52,52.7 47.9,52.2 52.5,45 48.4,44.8 50,52.7 54.1,52.8 58,52.8 93.23,98.1 98.23,93.1 98.23,89.1 98.23,85.1 98.23,81.1 98.23,77.1 98.23,73.1 98.23,69.1 98.23,65.1 98.23,61.1 98.23,57.1 98.23,53.1 98.23,49.1 98.23,45.1 98.23,41.1 98.23,37.1 98.23,33.1 98.23,29.1 98.23,25.1 98.23,21.1 98.23,17.1 98.23,12.1 98.23,7.1 94.23,7.1 92.23,2.1 89.23,2.1 85.23,2.1 79.23,2.1 74.23,2.1 68.23,2.1 62.23,2.1 56.23,2.1 51.23,2.1 45.23,2.1 39.23,2.1 33.23,2.1 27.23,2.1 22.23,2.1 18.23,2.1 13.23,2.1 7.23,2.1 6.23,6.1 1.23,8.1 1.23,13.1 1.23,18.1 1.23,23.1 1.23,27.1 1.23,32.1 1.23,37.1 1.23,41.1 1.23,45.1 1.23,50.1 1.23,55.1 1.23,60.1 1.23,66.1 1.23,71.1 2.23,77.1 1.23,81.1 1.23,86.1 1.23,91.1 7.23,94.1 9.23,98.1 14.23,98.1 20.23,98.1 26.23,98.1 31.23,98.1 37.23,98.1 43.23,98.1 49.23,98.1 54.23,98.1 60.23,98.1 65.23,98.1 71.23,98.1 77.23,98.1 84.23,98.1 92.23,93.1 86.23,93.1 92.23,89.1 86.23,89.1 95.33,78.1 94.23,81.4 85.23,85.1 95.23,70.1 95.23,67.1 95.23,59.1 95.1,53.27 94.23,50.1 89.43,49.5 88.13,47.4 85.23,46.3 81.33,46.2 83.23,49.7 86.13,49.5 78.03,48.3 74.73,46.3 70.93,46.3 75.43,49.7 71.63,49.8 66.33,48.3 69.53,43.1 72.33,43.1 76.23,43 80.03,43.1 78.53,39.3 75.13,39.3 67.23,41.2 64.73,43.2 61.83,43.7 59.83,45.4 56.03,46.6 56.83,44.3 59.63,42.6 55.13,42.2 48.53,41.7 51.03,39.7 53.93,40 52.83,37.1 52.73,33.6 51.43,29.8 49.13,31.8 47.93,35.3 48.03,38.6 46.83,30.9 49.93,27.7 46.53,26.9 44.33,23.7 43.03,19.1 45.83,15.8 49.23,16.3 50.23,19.9 50.33,24 46.93,20.9 43.43,27.5 43.43,31.7 43.33,35.7 43.33,39.8 42.53,47 42.63,44.2 40.43,48.9 40.13,44.5 40.33,40.4 40.23,37.4 40.13,34.4 11.8,27.7 7.2,27.7 7.1,20.3 10.7,19.9 12.8,21.6 7.4,17.1 7.1,13.5 10.8,15.4 16.1,17 18.3,19.5 18.4,22.8 22.1,21.8 26,21.7 30.6,21.7 30.1,24.4 26.8,24.5 26.2,27.9 28.9,26.6 29.8,32.8 28.6,30 28.9,35.5 24.8,35.7 26.9,32.9 22.3,32.6 22.2,29 33.3,37.8 33.3,34.7 33.3,30.9 33.6,28 37.9,25.5 40.1,28.5 37.5,33.2 37.5,36.3 37.2,41.8 34.9,44 37.8,47.7 55,33.5 55.2,36.8 58.4,37.8 62.1,37.1 66.2,37 70.2,37 74.4,37 78.3,37 81.3,38.5 84.5,35 87.9,36.4 89.3,38.6 92.3,41.1 92.4,43.5 92.5,33 94.8,35.6 95,39.7 95,44.1 95,48 92.4,47.8 87.7,33.2 84.4,31.5 81,28.2 82.6,27 85.5,29.9 88.9,30.3 92.6,29.9 95.4,32 95.4,28.1 95.5,24.2 93.9,21.8 89.9,18.1 92.1,19.4 88.8,22 86.1,24.8 88.6,26.6 92.7,25.9 86.1,16.2 88.6,13.5 86.1,11.6 89.3,6.7 91.5,8.5 93.7,10.5 95.3,12.2 95.2,15.5 95.3,18.9 92.4,16.9 92.7,13.6 85.5,6.7 81.4,6.8 78.1,7.6 75.9,10.1 82.1,10.9 83.9,16.5 83.7,13.6 80.3,13.4 75.5,6.7 71,6.7 65.6,9.9 73.6,13.9 69.5,13.6 71.7,11 63.4,13.8 58.9,13.8 55.2,10 57.4,7.4 61.3,7.1 64.8,6.9 61.4,11.1 52.5,17.1 51.5,14 52.8,7.9 48.8,7 44.5,7.1 42.5,9.5 45.9,11.5 47.9,13.9 50.1,10.9 37.7,18.1 39.3,19.9 39.3,14.2 35.2,15.6 37,10.3 41.6,6.7 37.9,6.8 34.9,7.5 32.4,6.8 28.2,6.8 24.9,7.3 26.4,10.8 31.1,10.8 33.7,10.3 29.6,13.5 31.8,16 34.1,18.5 34.4,21.2 37.5,22 39.4,25.4 28.4,18.7 23.4,18.5 25.6,15.6 22.7,12.5 20.6,16.1 18.4,16 15.7,10.7 22.3,6.8 17.2,6.7 12,6.8 8.4,7.6 8,10.9 13.1,10.6 11.4,12.8 56.2,13 43.2,12.9 82.5,24.6 84.7,22.5 83.4,19.3 80.7,16.7 77.8,19.4 80.7,20.1 78.4,23.7 75.9,25.9 72.8,25.9 74.1,23 78.5,15.9 74.6,15.8 70.8,15.9 75.7,18.8 71.5,18.8 67.8,18.9 71.8,22.4 69.4,24.9 66.7,26.9 63.3,25.8 61.7,23.2 65.5,18.5 62,20 67.9,15.8 61.4,16.3 58.7,15.9 55.8,16.8 53.8,19.1 59,19.2 59.1,22.3 59.1,25.7 55.9,23.8 56.2,20.3 53.8,26 54.9,29.8 57.9,27.9 62.6,29.1 67,29.2 70.2,27.9 74.1,27.8 72.3,30.3 77.5,28.1 80.7,30.4 76.1,30.5 75.1,32.9 78.4,32.8 82.4,32.8 72.2,33.8 68.5,34 64.7,33.9 60.7,34 57.5,33.9 80.5,35 88.7,51.7 86.2,54.4 83.8,51.6 79.4,54.6 77.2,51.5 74.1,54.4 72.3,51.7 72.1,56.7 75.5,56.7 78.8,56.7 82,56.7 86.5,56.7 86.3,60 90.4,60.1 92.8,58.3 92,55.6 95,56.1 95.13,63.8 92.83,66.6 92.93,69.6 90.43,70.8 87.33,69.2 85.13,72.1 86.07,75.2 92.27,77 91.57,79.6 89.17,81.7 84.97,82.9 81.37,82.7 78.97,84.6 76.47,84.5 75.07,82.3 71.37,82.3 68.47,82.3 64.97,82.1 68.67,85.3 70.77,87.8 73.97,87.9 72.67,84.9 72.27,90.5 62.17,79.3 59.27,76.5 50.07,66.9 47.17,67.3 40.97,60.8 43.47,57.7 39.37,55.5 46.35,44.43 46.35,41.2 46.36,36.64 91.06,84.67 95.53,74.2 67.57,63.8 63.97,62.2 60.17,62.3 60.47,59.2 51.47,56.2 62,52.8 19.2,56.1 13.3,55.4 16.6,62.4 23.4,62.4 39.37,58.1 30.87,55.9 27.27,55.9 18.2,10.6 40.27,85.8 46.37,88.9 43.87,85.9 36.47,86 38.67,80.7 51.17,95 45.67,95 38.77,95 29.47,95 21.67,92.2 16.27,92.5 10.67,93.1 30.5,59.9 31.6,29.5 31.7,33.1 31.8,36.9 31.8,39.7 18.4,53.3 79.77,63.2 74.57,63.5 71.57,63.6 72.27,61.7 69.77,59.5 74.07,58.9 76.07,61.2 49.47,58.4 52.07,58.4 55.57,58.7 14.5,20.3 14.4,58.4 14.5,67.2 45.37,72.9 49.77,73 53.37,73 50.17,71.4 44.97,71.3 65.77,62.9 26.9,62.2 69.2,57.1 13.1,40 10.2,31.2 7.2,24.3 10.6,24.7 16,25.3 13.5,13.3 41.1,15.1 86.9,43 82.13,86.2 59.93,47.7
  pour Top: -9,106.5 106.7,106.5 106.7,-6 -8.9,-6 -9,-6
  pour Bottom: -13.9,48.2 -13.9,-8 31,-8 111.1,-8 111.1,102.9 -13.9,102.9
MISO_5V  (via drill 0.35)
  Top 0.305: IC4.12 63.77,41.6 57.4,41.6 54.88,44.12 R28.2
  Bottom 0.305: Q3.3 54.88,48.58 R28.2
  other vias: 54.88,46.5
MOSI_5V  (via drill 0.35)
  Top 0.305: R26.2 61.41,42.21 65.29,42.21 68.09,39.41 IC4.11
  Bottom 0.305: R26.2 57.12,48.58 Q2.3
  other vias: 57.12,46.5
N$1  (via drill 0.35)
  Top 0.305: 1-A.K 34.48,14.1 TR15.3
  other vias: 35.5,14.1
N$2  (via drill 0.35)
  Bottom 0.305: R48.2 32.5,13.88 1-A.A
  other vias: 32.62,14
N$3
  Bottom 0.305: R49.2 14.37,65.31 TR16.1
N$4
  Bottom 0.305: R47.2 38.08,11.9 TR15.1
N$5  (via drill 0.35)
  Bottom 0.305: TR16.3 16.61,66.62 2-A.K
  other vias: 16,66.62
N$6  (via drill 0.35)
  Bottom 0.305: 2-A.A 16,69.08 R50.2
  other vias: 16,68.38
N$7  (via drill 0.35)
  Bottom 0.305: R2.2 3V3.A
  other vias: 87.12,86
N$8  (via drill 0.35)
  Top 0.305: R3.2 5V.A
  other vias: 92.65,86
N$9
  Bottom 0.305: R4.2 12.57,35.88 TR1.1
N$10
  Bottom 0.305: TR21.1 14.82,49.12 R53.2
N$11  (via drill 0.35)
  Top 0.305: 4-A.K 16.48,35.12 TR1.3
  other vias: 16.6,35
N$12  (via drill 0.35)
  Top 0.305: 4-A.A 15.88,37 R6.2
  other vias: 15.88,38
N$13  (via drill 0.35)
  Bottom 0.305: TR21.3 16.48,50.12 3-A.K
  other vias: 16,50.12
N$14
  Bottom 0.305: R7.2 12.57,20.38 TR2.1
N$15  (via drill 0.35)
  Top 0.305: IC1.60 39.28,51.7 R1.1
  other vias: 39.28,51.78
N$16  (via drill 0.35)
  Bottom 0.406: TR2.3 16.5,19.6 5-A.K
  other vias: 16.5,19.62
N$17  (via drill 0.35)
  Bottom 0.406: R8.2 16.5,21.88 5-A.A
  other vias: 16.5,21.38
N$18
  Bottom 0.305: R9.2 22.07,10.97 TR3.1
N$19  (via drill 0.35)
  Bottom 0.305: TR3.3 19.3,14 6-A.K
  other vias: 18.38,14
N$20  (via drill 0.35)
  Bottom 0.305: R10.2 16.75,13.88 6-A.A
  other vias: 16.62,14
N$21
  Bottom 0.305: R11.2 28.12,14.32 TR4.1
N$22  (via drill 0.35)
  Top 0.305: 1-B.K 28.6,14 TR4.3
  other vias: 30.1,15.5
N$23  (via drill 0.35)
  Top 0.305: 1-B.A R12.1
  other vias: 25,13.88
N$24  (via drill 0.35)
  Top 0.152: 3-A.A v16,52.08
  Bottom 0.305: v16,52.08 16,53.38 R54.2
N$25
  Bottom 0.305: TR5.1 11.93,71.75 R13.2
N$26  (via drill 0.35)
  Top 0.305: 2-B.K 16.18,73.12 TR5.3
  other vias: 16.6,72.7
N$27  (via drill 0.35)
  Bottom 0.305: 2-B.A 16,75.58 R14.2
  other vias: 16,74.88
N$28
  Bottom 0.305: R15.2 12.18,56.55 TR6.1
N$29  (via drill 0.35)
  Bottom 0.305: TR6.3 16.48,57.62 3-B.K
  other vias: 16,57.62
N$30  (via drill 0.35)
  Bottom 0.305: 3-B.A 16,60.88 R16.2
  other vias: 16,59.38
N$31
  Bottom 0.305: R17.2 14.07,40.88 TR7.1
N$32  (via drill 0.35)
  Top 0.305: 4-B.K 16.48,41.62 TR7.3
  other vias: 16.6,41.5
N$33  (via drill 0.35)
  Top 0.305: 4-B.A 16,44.38 R18.2
  other vias: 15.88,44.5
N$34
  Bottom 0.305: R19.2 12.18,25.55 TR8.1
N$35  (via drill 0.35)
  Bottom 0.305: TR8.3 16.73,26.62 5-B.K
  other vias: 16.5,26.62
N$36  (via drill 0.35)
  Top 0.305: R20.2 16.5,29.38 5-B.A
  other vias: 15.88,30
N$37
  Bottom 0.305: R21.2 12.62,14.32 TR9.1
N$38  (via drill 0.35)
  Top 0.305: 6-B.A R22.2
  other vias: 10,13.88
N$39  (via drill 0.35)
  Top 0.305: 6-B.K 13.38,15.5 TR9.3
  other vias: 14.6,15.5
N$40
  Bottom 0.305: TR10.1 86.17,39.7 R55.2
N$41
  Bottom 0.305: R32.1 R31.1 90.88,37.08 X9.1
N$42
  Bottom 0.305: R33.2 68,9.62 | X25.1 68,9.6 68,9.62 | R34.2 68,9.62
N$43
  Bottom 0.305: R36.2 54.9,11.8 X12.1 R35.2
N$44
  Bottom 0.305: R38.2 55,23.4 55,22.6 | 55,22.6 X7.1 | R37.2 55,22.62 55,22.6
N$45
  Bottom 0.305: X23.1 78.5,9.6 78.5,9.62 | 78.5,9.62 R39.2 | R40.2 78.5,9.62
N$46
  Bottom 0.305: R41.2 68,23.6 68,22.6 | 68,22.6 X10.1 | R42.2 68,22.62 68,22.6
N$47
  Bottom 0.305: X18.1 89.8,10 | 89.8,10 88.4,10 R43.2 | R44.2 89.8,9.93 89.8,10
N$48
  Bottom 0.305: X20.1 81,22.6 | 81,22.6 81,23.43 R46.2 | R45.2 81,22.62 81,22.6
N$49
  Bottom 0.305: R51.2 90.38,20.5 | X21.1 90.4,20.5 90.38,20.5 | R52.2 90.38,20.5
N$50  (via drill 0.35)
  Top 0.305: TX.K 82.9,37.98 TR10.3
  other vias: 82.9,38.75
N$51
  Top 0.305: TX.A R56.2
N$52
  Bottom 0.305: TR11.1 87.92,43.95 R57.2
N$53  (via drill 0.35)
  Top 0.305: RX.K 83,43.23 v82.9,43.13
  Bottom 0.305: v82.9,43.13 TR11.3
N$54
  Top 0.305: RX.A R58.2
N$55
  Bottom 0.305: TR12.1 29.62,62.67 R59.2
N$56  (via drill 0.35)
  Bottom 0.305: TR12.3 32.38,64.17 PA10.K
  other vias: 32.38,66
N$57  (via drill 0.35)
  Top 0.305: PA10.A 30.38,66.25 R60.2
  other vias: 30.38,68
N$58
  Bottom 0.305: TR13.1 21.4,61.23 R61.2
N$59  (via drill 0.35)
  Bottom 0.305: TR13.3 23.88,64.28 PC9.K
  other vias: 23.88,66
N$60  (via drill 0.35)
  Bottom 0.305: R62.2 PC9.A
  other vias: 22.12,66
N$61
  Bottom 0.305: TR14.1 25.62,63.02 R63.2
N$62  (via drill 0.35)
  Bottom 0.305: TR14.3 27.85,65.66 PC8.K
  other vias: 27.88,66
N$63  (via drill 0.35)
  Bottom 0.305: R64.2 PC8.A
  other vias: 26.12,66
N$64
  Bottom 0.305: TR17.1 34.23,62.92 R65.2
N$65  (via drill 0.35)
  Bottom 0.305: TR17.3 36.38,64.08 PB2.K
  other vias: 36.38,66
N$66  (via drill 0.35)
  Top 0.305: PB2.A R66.2
  other vias: 34.62,68
N$67
  Bottom 0.305: X14.1 24.75,24 R70.1 R69.1
N$68
  Bottom 0.305: R67.1 R68.1 35.75,24 X17.1
N$69
  Bottom 0.305: R72.1 18,89.88 | X13.1 18,90.68 18,89.9 18,89.88 | R71.1 18,89.88
N$70
  Bottom 0.305: X11.1 44.5,9.6 44.5,9.62 | 44.5,9.62 44.5,10.5 R73.1 | R74.1 44.5,9.62
N$71
  Bottom 0.305: R77.1 38.92,74.05 Q9.1
N$72
  Bottom 0.305: Q10.1 25.02,75.95 R78.1
N$73  (via drill 0.35)
  Top 0.406: CAN_TX.K R75.1
  other vias: 38.15,78
N$74
  Bottom 0.305: R81.2 81.3,73.5 | 81.3,73.5 X24.1 | R82.2 81.3,73.42 81.3,73.5
N$75  (via drill 0.35)
  Top 0.305: R76.1 CAN_RX.K
  other vias: 22.35,78
N$76
  Bottom 0.305: X27.1 69.8,73.5 | 69.8,73.5 R85.2 | R86.2 69.8,73.42 69.8,73.5
N$77
  Bottom 0.305: R87.2 X28.1 93.12,54.42 R88.2
N$78
  Bottom 0.305: R89.2 X29.1 93.12,64.92 R90.2
N$79
  Bottom 0.305: R91.2 X30.1 93.12,75.42 R92.2
N$80
  Bottom 0.406: Q9.3 42.2,75.65 R75.2
N$81
  Bottom 0.305: R96.2 79,59 X32.1 R95.2
N$82
  Bottom 0.305: R97.2 X33.1 69.88,61.5 R98.2
N$83
  Bottom 0.305: R99.2 X34.1 69.88,49.5 R100.2
N$84
  Bottom 0.305: X35.1 81.4,49.5 81.38,49.5 | 81.38,49.5 R101.2 | R102.2 81.38,49.5
N$85
  Bottom 0.305: Q10.3 20.4,77.75 R76.2
NRST  (via drill 0.35)
  Top 0.305: S2.A1 50.72,38.03 v43.53,45.23 | v18,85 18,85.02 13.72,89.29 13.4,89.29 | SL1.5 3.2,89.29 13.4,89.29 | IC1.7 43.53,52.71 C23.2 | 13.4,89.29
  Bottom 0.305: v43.53,45.23 C23.2 40.83,56.8 35.86,56.8 33.4,59.26 20.54,59.26 19.9,59.9 19.9,72.4 21.45,73.95 21.45,81.55 v18,85
  other vias: 43.53,54.1
NSS_5V
  Bottom 0.305: Q1.3 62.88,48.58 R24.2 69.97,39.41 IC4.10
PA10  (via drill 0.35)
  Top 0.305: IC1.43 34.53,61 R59.1
  other vias: 31.38,61
PB0  (via drill 0.4)
  Top 0.305: v50.1,63.2 47.95,63.2 IC1.25
  Bottom 0.305: v50.1,63.2 64.84,63.2 66.32,64.68 66.7,65.06 90.64,65.06 X29.2
PB1
  Top 0.305: IC1.26 47.74,63.7 48.9,63.7 65.7,80.5 85.7,80.5 X30.2
PB2  (via drill 0.35)
  Top 0.305: IC1.27 43.03,59.7 v43,59.7
  Bottom 0.305: v43,59.7 37.27,59.7 R65.1
PC1
  Top 0.305: IC1.9 45.49,52.22 46.87,50.84 62.39,50.84 66.64,55.1 66.64,65.23 77.41,76 X24.2
PC2
  Top 0.305: IC1.10 46.86,51.5 61.8,51.5 64.9,54.6 64.9,70.9 X27.2
PC4  (via drill 0.4)
  Top 0.305: IC1.24 47.81,62.36 58.94,62.36 v63.6,57.7
  Bottom 0.305: X28.2 89.5,55.7 65.6,55.7 v63.6,57.7
PC8  (via drill 0.35)
  Top 0.305: IC1.39 35.28,63.08 29.46,63.08 R63.1
  other vias: 27.38,61
PC9  (via drill 0.35)
  Top 0.305: IC1.40 35.03,62.63 30.1,62.63 27.84,60.37 24.01,60.37 R61.1
  other vias: 23.38,61
PC13
  Top 0.305: IC1.2 44.16,48.54 63.69,48.54 67.15,52 X34.2
PC14
  Top 0.305: IC1.3 44.21,49.2 63.6,49.2 67.5,53.1 80.44,53.1 80.55,52.95 X35.2
PC15  (via drill 0.35)
  Top 0.305: IC1.4 42.76,51.36 C1.2 | v40.2,43.1 34.98,37.88 S1.A1
  Bottom 0.305: C1.2 41.88,51.36 41.2,50.68 41.2,44.1 v40.2,43.1
  other vias: 42.55,51.36
PH0
  Top 0.305: IC1.5 45.07,49.76 63.26,49.76 77.3,64 X32.2
PH1
  Top 0.305: IC1.6 45.22,50.31 62.87,50.31 68.23,55.67 68.23,62.63 X33.2
SCK_5V
  Bottom 0.305: Q5.3 49.12,48.58 R30.2 54.83,40.8 62.03,40.8 IC4.13
SCL1
  Top 0.305: IC1.61 33.16,44.88 33.16,42.9 30.18,39.92 30.18,34.42 X14.3
SCL2  (via drill 0.35)
  Top 0.305: IC1.28 43.02,60.4 42.8,60.4 41.5,59.1 v41.5,55
  Bottom 0.305: v41.5,55 40.23,53.73 40.23,51 38.6,49.37 38.6,31.85 X17.3
SDA1
  Top 0.305: X14.2 27.8,26.75 30.77,29.73 30.77,39.86 33.62,42.7 33.62,44.63 IC1.62
SDA2  (via drill 0.35)
  Top 0.305: IC1.29 42.77,60.86 42.61,60.86 40.87,59.11 v40.87,53.39 v40.86,53.38
  Bottom 0.305: v40.86,53.38 40.86,50.99 39.46,49.58 39.46,28.71 37.5,26.75 X17.2
SPI1_MISO  (via drill 0.35)
  Top 0.305: IC1.22 47.49,60.62 v47.8,60.62
  Bottom 0.305: v47.8,60.62 48.4,60.62 54.88,54.14 R27.2 54.95,53.92 Q3.2
SPI1_MOSI  (via drill 0.35)
  Top 0.305: IC1.23 47.64,61.48 v47.82,61.48
  Bottom 0.305: Q2.2 58.95,53.92 R25.2 51.4,61.48 v47.82,61.48
SPI1_NSS  (via drill 0.35)
  Top 0.305: IC1.20 50.18,61.9 56.07,61.9 v61.1,56.87
  Bottom 0.305: Q1.2 62.95,53.62 62.9,53.88 62.89,53.93 R23.2 62.88,55.12 61.13,56.87 v61.1,56.87
SPI1_SCK  (via drill 0.35)
  Top 0.305: IC1.21 45.5,57.92 v45.5,57.8
  Bottom 0.305: Q5.2 50.88,51.63 R29.2 50.88,54.5 49.98,55.4 47.9,55.4 v45.5,57.8
SPI2_MISO  (via drill 0.35)
  Top 0.305: v38.17,66.9 38.17,63.02 IC1.35
  Bottom 0.305: X8.2 67.25,88.09 52.89,73.73 45,73.73 v38.17,66.9
SPI2_MOSI  (via drill 0.35)
  Top 0.305: IC1.36 37.64,62.84 37.53,62.95 v37.53,65.27
  Bottom 0.305: v37.53,65.27 44.45,72.19 53.89,72.19 69.75,88.05 X8.1
SPI2_NSS
  Top 0.305: X8.4 62.3,86.3 53,77 47.6,77 39.79,69.19 IC1.33
SPI2_SCK  (via drill 0.35)
  Top 0.305: IC1.34 38.8,63.1 38.8,68.8 v38.9,68.9
  Bottom 0.305: v38.9,68.9 47.3,77.3 53.9,77.3 64.75,88.15 X8.3
SWCLK  (via drill 0.4)
  Top 0.305: IC1.49 33.7,55.48 v33.7,55.5
  Bottom 0.305: SL1.2 10.91,82.19 17.7,75.4 17.7,59.35 20.04,57.01 32.19,57.01 v33.7,55.5
SWDIO  (via drill 0.35)
  Top 0.305: IC1.46 34.21,59.2 31.16,59.2 v29.63,57.67
  Bottom 0.305: SL1.4 6.48,87.27 18.26,75.49 18.26,59.54 20.13,57.67 v29.63,57.67
UART_RX
  Top 0.305: IC1.54 37.12,53.78 38.17,53.78 41.14,50.82 41.14,18.01 49.5,9.65 X11.3
UART_TX  (via drill 0.35)
  Top 0.305: IC1.53 36.87,54.24 38.37,54.24 41.6,51.01 41.6,18.5 v46.5,13.6
  Bottom 0.305: X11.2 47,13.1 v46.5,13.6
USART1_RX  (via drill 0.35)
  Top 0.305: IC1.17 v56.99,57.51 v57,57.5
  Bottom 0.305: X9.3 88.12,42.25 R57.1 86.88,41 70.1,41 64.5,46.6 64.5,55.3 62.3,57.5 v57,57.5
USART1_TX  (via drill 0.35)
  Top 0.305: IC1.16 48.58,55.37 63.25,55.37 v63.87,54.75
  Bottom 0.305: X9.2 88.12,39.75 R55.1 87.08,40.54 69.91,40.54 64.04,46.41 64.04,54.58 v63.87,54.75
USART2_RX  (via drill 0.4)
  Top 0.305: IC1.52 36.8,54.88 v36.8,55.3
  Bottom 0.305: X13.3 12.98,85.49 18.8,79.67 18.8,59.7 20.2,58.3 32.1,58.3 34.8,55.6 36.5,55.6 v36.8,55.3
USART2_TX  (via drill 0.4)
  Top 0.305: v35.41,56.32 36.14,55.59 36.14,55.32 36.14,54.93 IC1.51
  Bottom 0.305: v35.41,56.32 32.93,58.8 20.35,58.8 19.36,59.79 19.36,79.76 15.15,83.96 15.15,90.38 X13.2
VCAP
  Top 0.305: C21.2 C20.2 45.99,64.78 44.16,62.95 IC1.30
(copper drawn outside any net)
  shapes: Top area x1

## Text on the board
tNames: SWO | MISO | MOSI | GND | 3V3 | NRST | RX / (PC11) | NSS | SCK | 5V | SWDIO | TX / (PC10) | Vcc | GND | USART | SPI | SWCLK | 3V3 | GND | GND | GND | PC0 | PC1 | PB1 | VCC | VCC | VCC | Sensormain_Exodia | PC9 | PB2 | GND | GND | GND | PB0 | PH1 | PH0 | VCC | GPIO | VCC | VCC | GND | GND | GND | PC4 | PC13 | PC14 | VCC | VCC | VCC | USER | RESET | GND | RX | TX | VCC | Wireless / Module | GND | GND | ADC | SCL2 / (PB8) | SCL2 / (PB10) | SDA1 / (PB9) | SDA2 / (PB11) | GND | ADC2 | VCC | GND | ADC4 | VCC | GND | ADC6 | VCC | GND | VCC | VCC | ADC7 | I2C | VCC | ENCODER | UART | GND | ADC5 | VCC | ADC0 | GND | VCC | ADC１ | GND | VCC | ADC3 | GND | Vcc | TX / (PC12) | RX / (PD2) | VCC
bNames: 3V3 | 5V | 5V | 3V3 | 3V3 | 3V3 | 5V | 5V | 5V | 5V | 3V3 | 3V3 | 3V3 | 5V | 5V | 5V | 3V3 | 3V3 | 3V3 | 5V | 5V | 3V3 | 5V | 3V3 | 5V | 5V | 3V3 | 3V3 | 5V | 3V3 | 3V3 | 5V | 5V | 3V3 | 5V | 5V | 3V3 | 5V | 3V3 | 5V | 3V3 | 5V | 3V3 | 3V3 | 5V